# Altium schematic sheet DAC.SchDoc
size Letter
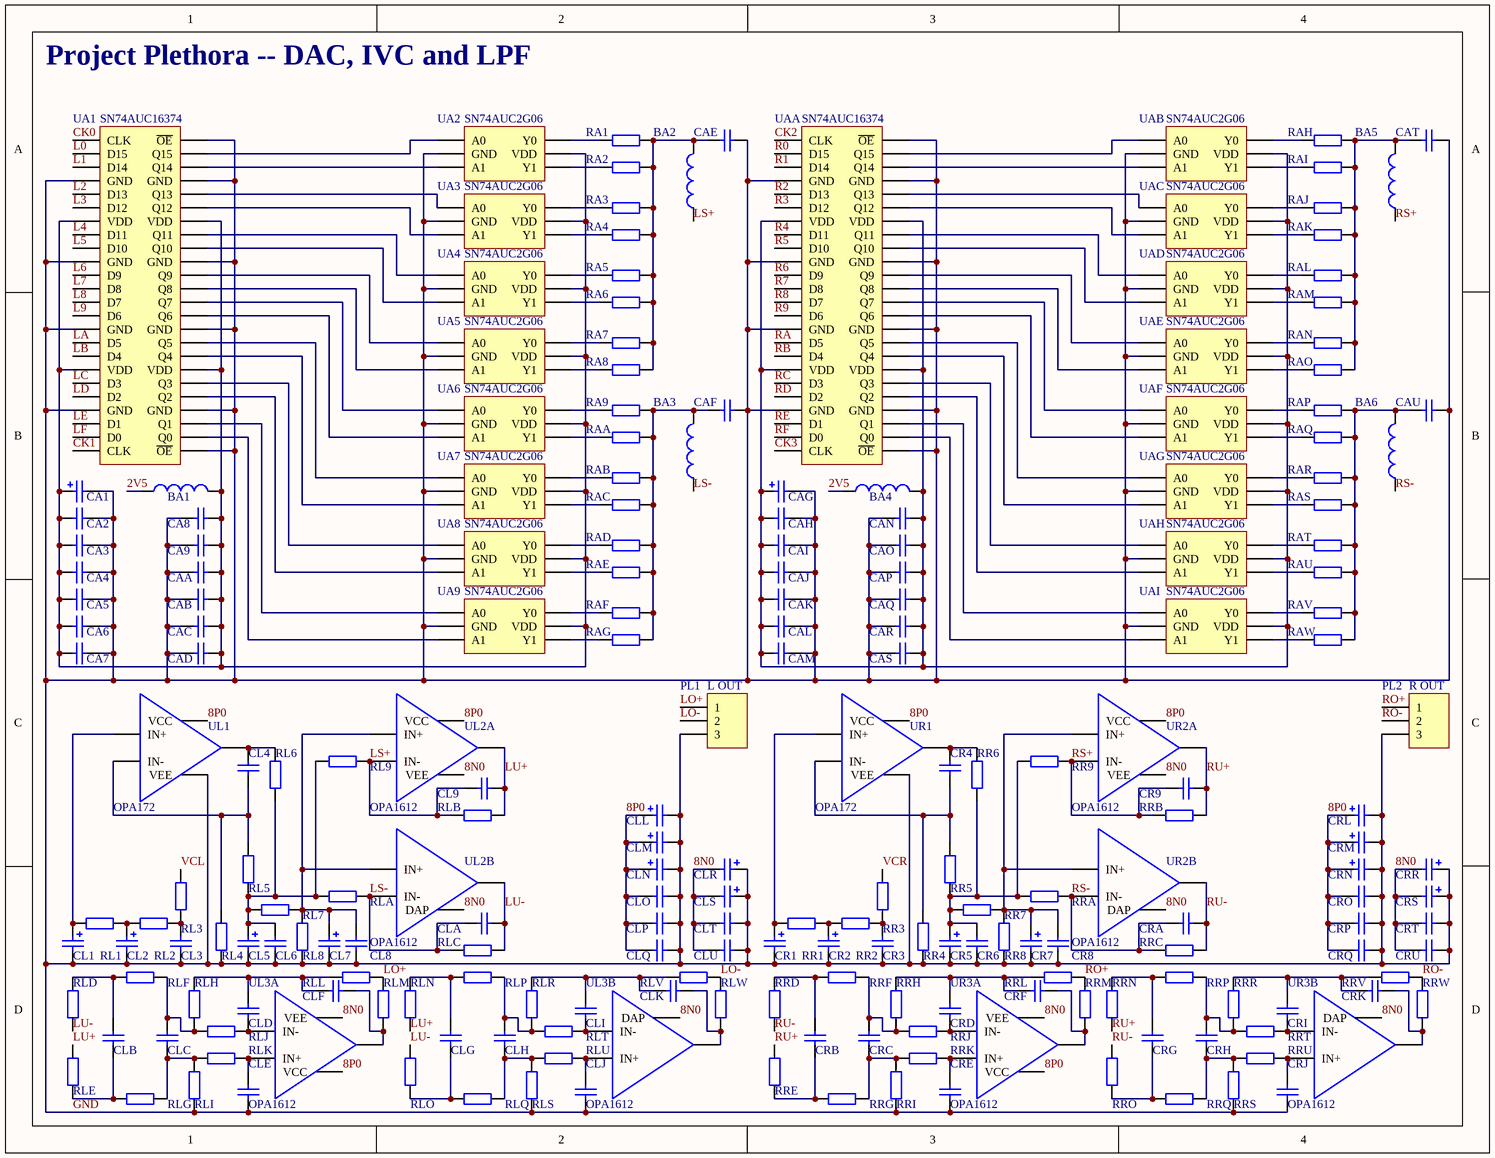
[diagram p0: DAC.SchDoc]

## Parts
BA1  Inductor  [0402]  (value not drawn)
BA2  Inductor  [0402]  (value not drawn)
BA3  Inductor  [0402]  (value not drawn)
BA4  Inductor  [0402]  (value not drawn)
BA5  Inductor  [0402]  (value not drawn)
BA6  Inductor  [0402]  (value not drawn)
CA1  Cap Pol2  [0603]  (value not drawn)
CA2  Cap  [0402]  (value not drawn)
CA3  Cap  [0402]  (value not drawn)
CA4  Cap  [0402]  (value not drawn)
CA5  Cap  [0402]  (value not drawn)
CA6  Cap  [0402]  (value not drawn)
CA7  Cap  [0402]  (value not drawn)
CA8  Cap  [0402]  (value not drawn)
CA9  Cap  [0402]  (value not drawn)
CAA  Cap  [0402]  (value not drawn)
CAB  Cap  [0402]  (value not drawn)
CAC  Cap  [0402]  (value not drawn)
CAD  Cap  [0402]  (value not drawn)
CAE  Cap  [0402]  (value not drawn)
CAF  Cap  [0402]  (value not drawn)
CAG  Cap Pol2  [0603]  (value not drawn)
CAH  Cap  [0402]  (value not drawn)
CAI  Cap  [0402]  (value not drawn)
CAJ  Cap  [0402]  (value not drawn)
CAK  Cap  [0402]  (value not drawn)
CAL  Cap  [0402]  (value not drawn)
CAM  Cap  [0402]  (value not drawn)
CAN  Cap  [0402]  (value not drawn)
CAO  Cap  [0402]  (value not drawn)
CAP  Cap  [0402]  (value not drawn)
CAQ  Cap  [0402]  (value not drawn)
CAR  Cap  [0402]  (value not drawn)
CAS  Cap  [0402]  (value not drawn)
CAT  Cap  [0402]  (value not drawn)
CAU  Cap  [0402]  (value not drawn)
CL1  Cap Pol2  [0603]  (value not drawn)
CL2  Cap Pol2  [0603]  (value not drawn)
CL3  Cap  [0603]  (value not drawn)
CL4  Cap  [0603]  (value not drawn)
CL5  Cap Pol2  [0603]  (value not drawn)
CL6  Cap  [0603]  (value not drawn)
CL7  Cap Pol2  [0603]  (value not drawn)
CL8  Cap  [0603]  (value not drawn)
CL9  Cap  [0603]  (value not drawn)
CLA  Cap  [0603]  (value not drawn)
CLB  Cap  [0603]  (value not drawn)
CLC  Cap  [0603]  (value not drawn)
CLD  Cap  [0603]  (value not drawn)
CLE  Cap  [0603]  (value not drawn)
CLF  Cap  [0603]  (value not drawn)
CLG  Cap  [0603]  (value not drawn)
CLH  Cap  [0603]  (value not drawn)
CLI  Cap  [0603]  (value not drawn)
CLJ  Cap  [0603]  (value not drawn)
CLK  Cap  [0603]  (value not drawn)
CLL  Cap Pol2  [0603]  (value not drawn)
CLM  Cap Pol2  [0603]  (value not drawn)
CLN  Cap Pol2  [0603]  (value not drawn)
CLO  Cap  [0603]  (value not drawn)
CLP  Cap  [0603]  (value not drawn)
CLQ  Cap  [0603]  (value not drawn)
CLR  Cap Pol2  [0603]  (value not drawn)
CLS  Cap Pol2  [0603]  (value not drawn)
CLT  Cap  [0603]  (value not drawn)
CLU  Cap  [0603]  (value not drawn)
CR1  Cap Pol2  [0603]  (value not drawn)
CR2  Cap Pol2  [0603]  (value not drawn)
CR3  Cap  [0603]  (value not drawn)
CR4  Cap  [0603]  (value not drawn)
CR5  Cap Pol2  [0603]  (value not drawn)
CR6  Cap  [0603]  (value not drawn)
CR7  Cap Pol2  [0603]  (value not drawn)
CR8  Cap  [0603]  (value not drawn)
CR9  Cap  [0603]  (value not drawn)
CRA  Cap  [0603]  (value not drawn)
CRB  Cap  [0603]  (value not drawn)
CRC  Cap  [0603]  (value not drawn)
CRD  Cap  [0603]  (value not drawn)
CRE  Cap  [0603]  (value not drawn)
CRF  Cap  [0603]  (value not drawn)
CRG  Cap  [0603]  (value not drawn)
CRH  Cap  [0603]  (value not drawn)
CRI  Cap  [0603]  (value not drawn)
CRJ  Cap  [0603]  (value not drawn)
CRK  Cap  [0603]  (value not drawn)
CRL  Cap Pol2  [0603]  (value not drawn)
CRM  Cap Pol2  [0603]  (value not drawn)
CRN  Cap Pol2  [0603]  (value not drawn)
CRO  Cap  [0603]  (value not drawn)
CRP  Cap  [0603]  (value not drawn)
CRQ  Cap  [0603]  (value not drawn)
CRR  Cap Pol2  [0603]  (value not drawn)
CRS  Cap Pol2  [0603]  (value not drawn)
CRT  Cap  [0603]  (value not drawn)
CRU  Cap  [0603]  (value not drawn)
PL1  L OUT  [HDR1X3]
PL2  R OUT  [HDR1X3]
RA1  Res2  [0402]  (value not drawn)
RA2  Res2  [0402]  (value not drawn)
RA3  Res2  [0402]  (value not drawn)
RA4  Res2  [0402]  (value not drawn)
RA5  Res2  [0402]  (value not drawn)
RA6  Res2  [0402]  (value not drawn)
RA7  Res2  [0402]  (value not drawn)
RA8  Res2  [0402]  (value not drawn)
RA9  Res2  [0402]  (value not drawn)
RAA  Res2  [0402]  (value not drawn)
RAB  Res2  [0402]  (value not drawn)
RAC  Res2  [0402]  (value not drawn)
RAD  Res2  [0402]  (value not drawn)
RAE  Res2  [0402]  (value not drawn)
RAF  Res2  [0402]  (value not drawn)
RAG  Res2  [0402]  (value not drawn)
RAH  Res2  [0402]  (value not drawn)
RAI  Res2  [0402]  (value not drawn)
RAJ  Res2  [0402]  (value not drawn)
RAK  Res2  [0402]  (value not drawn)
RAL  Res2  [0402]  (value not drawn)
RAM  Res2  [0402]  (value not drawn)
RAN  Res2  [0402]  (value not drawn)
RAO  Res2  [0402]  (value not drawn)
RAP  Res2  [0402]  (value not drawn)
RAQ  Res2  [0402]  (value not drawn)
RAR  Res2  [0402]  (value not drawn)
RAS  Res2  [0402]  (value not drawn)
RAT  Res2  [0402]  (value not drawn)
RAU  Res2  [0402]  (value not drawn)
RAV  Res2  [0402]  (value not drawn)
RAW  Res2  [0402]  (value not drawn)
RL1  Res2  [0402]  (value not drawn)
RL2  Res2  [0402]  (value not drawn)
RL3  Res2  [0402]  (value not drawn)
RL4  Res2  [0402]  (value not drawn)
RL5  Res2  [0402]  (value not drawn)
RL6  Res2  [0402]  (value not drawn)
RL7  Res2  [0402]  (value not drawn)
RL8  Res2  [0402]  (value not drawn)
RL9  Res2  [0402]  (value not drawn)
RLA  Res2  [0402]  (value not drawn)
RLB  Res2  [0402]  (value not drawn)
RLC  Res2  [0402]  (value not drawn)
RLD  Res2  [0402]  (value not drawn)
RLE  Res2  [0402]  (value not drawn)
RLF  Res2  [0402]  (value not drawn)
RLG  Res2  [0402]  (value not drawn)
RLH  Res2  [0402]  (value not drawn)
RLI  Res2  [0402]  (value not drawn)
RLJ  Res2  [0402]  (value not drawn)
RLK  Res2  [0402]  (value not drawn)
RLL  Res2  [0402]  (value not drawn)
RLM  Res2  [0402]  (value not drawn)
RLN  Res2  [0402]  (value not drawn)
RLO  Res2  [0402]  (value not drawn)
RLP  Res2  [0402]  (value not drawn)
RLQ  Res2  [0402]  (value not drawn)
RLR  Res2  [0402]  (value not drawn)
RLS  Res2  [0402]  (value not drawn)
RLT  Res2  [0402]  (value not drawn)
RLU  Res2  [0402]  (value not drawn)
RLV  Res2  [0402]  (value not drawn)
RLW  Res2  [0402]  (value not drawn)
RR1  Res2  [0402]  (value not drawn)
RR2  Res2  [0402]  (value not drawn)
RR3  Res2  [0402]  (value not drawn)
RR4  Res2  [0402]  (value not drawn)
RR5  Res2  [0402]  (value not drawn)
RR6  Res2  [0402]  (value not drawn)
RR7  Res2  [0402]  (value not drawn)
RR8  Res2  [0402]  (value not drawn)
RR9  Res2  [0402]  (value not drawn)
RRA  Res2  [0402]  (value not drawn)
RRB  Res2  [0402]  (value not drawn)
RRC  Res2  [0402]  (value not drawn)
RRD  Res2  [0402]  (value not drawn)
RRE  Res2  [0402]  (value not drawn)
RRF  Res2  [0402]  (value not drawn)
RRG  Res2  [0402]  (value not drawn)
RRH  Res2  [0402]  (value not drawn)
RRI  Res2  [0402]  (value not drawn)
RRJ  Res2  [0402]  (value not drawn)
RRK  Res2  [0402]  (value not drawn)
RRL  Res2  [0402]  (value not drawn)
RRM  Res2  [0402]  (value not drawn)
RRN  Res2  [0402]  (value not drawn)
RRO  Res2  [0402]  (value not drawn)
RRP  Res2  [0402]  (value not drawn)
RRQ  Res2  [0402]  (value not drawn)
RRR  Res2  [0402]  (value not drawn)
RRS  Res2  [0402]  (value not drawn)
RRT  Res2  [0402]  (value not drawn)
RRU  Res2  [0402]  (value not drawn)
RRV  Res2  [0402]  (value not drawn)
RRW  Res2  [0402]  (value not drawn)
UA1  SN74AUC16374  [TSSOP48]
UA2  SN74AUC2G06  [SC706]
UA3  SN74AUC2G06  [SC706]
UA4  SN74AUC2G06  [SC706]
UA5  SN74AUC2G06  [SC706]
UA6  SN74AUC2G06  [SC706]
UA7  SN74AUC2G06  [SC706]
UA8  SN74AUC2G06  [SC706]
UA9  SN74AUC2G06  [SC706]
UAA  SN74AUC16374  [TSSOP48]
UAB  SN74AUC2G06  [SC706]
UAC  SN74AUC2G06  [SC706]
UAD  SN74AUC2G06  [SC706]
UAE  SN74AUC2G06  [SC706]
UAF  SN74AUC2G06  [SC706]
UAG  SN74AUC2G06  [SC706]
UAH  SN74AUC2G06  [SC706]
UAI  SN74AUC2G06  [SC706]
UL1  OPA172  [SC705]
UL2  OPA1612  [DFN8]  (parts A,B of 2)
UL3  OPA1612  [DFN8]  (parts A,B of 2)
UR1  OPA172  [SC705]
UR2  OPA1612  [DFN8]  (parts A,B of 2)
UR3  OPA1612  [DFN8]  (parts A,B of 2)

## Nets
2V5: BA1.1 BA4.1
8N0: CLR.2 CLS.2 CLT.1 CLU.1 CRR.2 CRS.2 CRT.1 CRU.1 UL2.4(VEE) UL2.9(DAP) UL3.4(VEE) UL3.9(DAP) UR2.4(VEE) UR2.9(DAP) UR3.4(VEE) UR3.9(DAP)
8P0: CLL.1 CLM.1 CLN.1 CLO.2 CLP.2 CLQ.2 CRL.1 CRM.1 CRN.1 CRO.2 CRP.2 CRQ.2 UL1.5(VCC) UL2.8(VCC) UL3.8(VCC) UR1.5(VCC) UR2.8(VCC) UR3.8(VCC)
CK0: UA1.25(CLK)
CK1: UA1.48(CLK)
CK2: UAA.25(CLK)
CK3: UAA.48(CLK)
GND: CA1.2 CA2.2 CA3.2 CA4.2 CA5.2 CA6.2 CA7.2 CA8.1 CA9.1 CAA.1 CAB.1 CAC.1 CAD.1 CAE.1 CAF.1 CAG.2 CAH.2 CAI.2 CAJ.2 CAK.2 CAL.2 CAM.2 CAN.1 CAO.1 CAP.1 CAQ.1 CAR.1 CAS.1 CAT.1 CAU.1 CL1.2 CL2.2 CL3.1 CL5.2 CL6.1 CL7.2 CL8.1 CLE.2 CLJ.2 CLL.2 CLM.2 CLN.2 CLO.1 CLP.1 CLQ.1 CLR.1 CLS.1 CLT.2 CLU.2 CR1.2 CR2.2 CR3.1 CR5.2 CR6.1 CR7.2 CR8.1 CRE.2 CRJ.2 CRL.2 CRM.2 CRN.2 CRO.1 CRP.1 CRQ.1 CRR.1 CRS.1 CRT.2 CRU.2 PL1.3 PL2.3 RL4.1 RL8.1 RLI.1 RLS.1 RR4.1 RR8.1 RRI.1 RRS.1 UA1.1(~{OE}) UA1.4(GND) UA1.10(GND) UA1.15(GND) UA1.21(GND) UA1.24(~{OE}) UA1.28(GND) UA1.34(GND) UA1.39(GND) UA1.45(GND) UA2.2(GND) UA3.2(GND) UA4.2(GND) UA5.2(GND) UA6.2(GND) UA7.2(GND) UA8.2(GND) UA9.2(GND) UAA.1(~{OE}) UAA.4(GND) UAA.10(GND) UAA.15(GND) UAA.21(GND) UAA.24(~{OE}) UAA.28(GND) UAA.34(GND) UAA.39(GND) UAA.45(GND) UAB.2(GND) UAC.2(GND) UAD.2(GND) UAE.2(GND) UAF.2(GND) UAG.2(GND) UAH.2(GND) UAI.2(GND) UL1.2(VEE) UR1.2(VEE)
L0: UA1.26(D15)
L1: UA1.27(D14)
L2: UA1.29(D13)
L3: UA1.30(D12)
L4: UA1.32(D11)
L5: UA1.33(D10)
L6: UA1.35(D9)
L7: UA1.36(D8)
L8: UA1.37(D7)
L9: UA1.38(D6)
LA: UA1.40(D5)
LB: UA1.41(D4)
LC: UA1.43(D3)
LD: UA1.44(D2)
LE: UA1.46(D1)
LF: UA1.47(D0)
LO+: PL1.1 RLL.2 RLM.1
LO-: PL1.2 RLV.2 RLW.1
LS+: BA2.1 CL9.2 RL9.2 RLB.1 UL2.2(IN-)
LS-: BA3.1 CLA.2 RLA.2 RLC.1 UL2.6(IN-)
LU+: CL9.1 RLB.2 RLE.2 RLN.1 UL2.1
LU-: CLA.1 RLC.2 RLD.1 RLO.2 UL2.7
R0: UAA.26(D15)
R1: UAA.27(D14)
R2: UAA.29(D13)
R3: UAA.30(D12)
R4: UAA.32(D11)
R5: UAA.33(D10)
R6: UAA.35(D9)
R7: UAA.36(D8)
R8: UAA.37(D7)
R9: UAA.38(D6)
RA: UAA.40(D5)
RB: UAA.41(D4)
RC: UAA.43(D3)
RD: UAA.44(D2)
RE: UAA.46(D1)
RF: UAA.47(D0)
RO+: PL2.1 RRL.2 RRM.1
RO-: PL2.2 RRV.2 RRW.1
RS+: BA5.1 CR9.2 RR9.2 RRB.1 UR2.2(IN-)
RS-: BA6.1 CRA.2 RRA.2 RRC.1 UR2.6(IN-)
RU+: CR9.1 RRB.2 RRE.2 RRN.1 UR2.1
RU-: CRA.1 RRC.2 RRD.1 RRO.2 UR2.7
VCL: RL3.2
VCR: RR3.2
NetBA1_2: BA1.2 CA1.1 CA2.1 CA3.1 CA4.1 CA5.1 CA6.1 CA7.1 CA8.2 CA9.2 CAA.2 CAB.2 CAC.2 CAD.2 UA1.7(VDD) UA1.18(VDD) UA1.31(VDD) UA1.42(VDD) UA2.5(VDD) UA3.5(VDD) UA4.5(VDD) UA5.5(VDD) UA6.5(VDD) UA7.5(VDD) UA8.5(VDD) UA9.5(VDD)
NetBA2_2: BA2.2 CAE.2 RA1.2 RA2.2 RA3.2 RA4.2 RA5.2 RA6.2 RA7.2 RA8.2
NetBA3_2: BA3.2 CAF.2 RA9.2 RAA.2 RAB.2 RAC.2 RAD.2 RAE.2 RAF.2 RAG.2
NetBA4_2: BA4.2 CAG.1 CAH.1 CAI.1 CAJ.1 CAK.1 CAL.1 CAM.1 CAN.2 CAO.2 CAP.2 CAQ.2 CAR.2 CAS.2 UAA.7(VDD) UAA.18(VDD) UAA.31(VDD) UAA.42(VDD) UAB.5(VDD) UAC.5(VDD) UAD.5(VDD) UAE.5(VDD) UAF.5(VDD) UAG.5(VDD) UAH.5(VDD) UAI.5(VDD)
NetBA5_2: BA5.2 CAT.2 RAH.2 RAI.2 RAJ.2 RAK.2 RAL.2 RAM.2 RAN.2 RAO.2
NetBA6_2: BA6.2 CAU.2 RAP.2 RAQ.2 RAR.2 RAS.2 RAT.2 RAU.2 RAV.2 RAW.2
NetCL1_1: CL1.1 RL1.1 UL1.3(IN+)
NetCL2_1: CL2.1 RL1.2 RL2.2
NetCL3_2: CL3.2 RL2.1 RL3.1
NetCL4_1: CL4.1 RL4.2 RL5.2 UL1.4(IN-)
NetCL4_2: CL4.2 RL6.2 UL1.1
NetCL5_1: CL5.1 CL6.2 RL5.1 RL6.1 RL7.2 RL9.1 RLA.1
NetCL7_1: CL7.1 CL8.2 RL7.1 RL8.2 UL2.3(IN+) UL2.5(IN+)
NetCLB_1: CLB.1 RLE.1 RLG.2
NetCLB_2: CLB.2 RLD.2 RLF.2
NetCLC_1: CLC.1 RLG.1 RLI.2 RLK.2
NetCLC_2: CLC.2 RLF.1 RLH.1 RLJ.2
NetCLD_1: CLD.1 RLJ.1 UL3.2(IN-)
NetCLD_2: CLD.2 CLF.2 RLH.2 RLL.1
NetCLE_1: CLE.1 RLK.1 UL3.3(IN+)
NetCLF_1: CLF.1 RLM.2 UL3.1
NetCLG_1: CLG.1 RLO.1 RLQ.2
NetCLG_2: CLG.2 RLN.2 RLP.2
NetCLH_1: CLH.1 RLQ.1 RLS.2 RLU.2
NetCLH_2: CLH.2 RLP.1 RLR.1 RLT.2
NetCLI_1: CLI.1 RLT.1 UL3.6(IN-)
NetCLI_2: CLI.2 CLK.1 RLR.2 RLV.1
NetCLJ_1: CLJ.1 RLU.1 UL3.5(IN+)
NetCLK_2: CLK.2 RLW.2 UL3.7
NetCR1_1: CR1.1 RR1.1 UR1.3(IN+)
NetCR2_1: CR2.1 RR1.2 RR2.2
NetCR3_2: CR3.2 RR2.1 RR3.1
NetCR4_1: CR4.1 RR4.2 RR5.2 UR1.4(IN-)
NetCR4_2: CR4.2 RR6.2 UR1.1
NetCR5_1: CR5.1 CR6.2 RR5.1 RR6.1 RR7.2 RR9.1 RRA.1
NetCR7_1: CR7.1 CR8.2 RR7.1 RR8.2 UR2.3(IN+) UR2.5(IN+)
NetCRB_1: CRB.1 RRE.1 RRG.2
NetCRB_2: CRB.2 RRD.2 RRF.2
NetCRC_1: CRC.1 RRG.1 RRI.2 RRK.2
NetCRC_2: CRC.2 RRF.1 RRH.1 RRJ.2
NetCRD_1: CRD.1 RRJ.1 UR3.2(IN-)
NetCRD_2: CRD.2 CRF.1 RRH.2 RRL.1
NetCRE_1: CRE.1 RRK.1 UR3.3(IN+)
NetCRF_2: CRF.2 RRM.2 UR3.1
NetCRG_1: CRG.1 RRO.1 RRQ.2
NetCRG_2: CRG.2 RRN.2 RRP.2
NetCRH_1: CRH.1 RRQ.1 RRS.2 RRU.2
NetCRH_2: CRH.2 RRP.1 RRR.1 RRT.2
NetCRI_1: CRI.1 RRT.1 UR3.6(IN-)
NetCRI_2: CRI.2 CRK.1 RRR.2 RRV.1
NetCRJ_1: CRJ.1 RRU.1 UR3.5(IN+)
NetCRK_2: CRK.2 RRW.2 UR3.7
NetRA1_1: RA1.1 UA2.6(Y0)
NetRA2_1: RA2.1 UA2.4(Y1)
NetRA3_1: RA3.1 UA3.6(Y0)
NetRA4_1: RA4.1 UA3.4(Y1)
NetRA5_1: RA5.1 UA4.6(Y0)
NetRA6_1: RA6.1 UA4.4(Y1)
NetRA7_1: RA7.1 UA5.6(Y0)
NetRA8_1: RA8.1 UA5.4(Y1)
NetRA9_1: RA9.1 UA6.6(Y0)
NetRAA_1: RAA.1 UA6.4(Y1)
NetRAB_1: RAB.1 UA7.6(Y0)
NetRAC_1: RAC.1 UA7.4(Y1)
NetRAD_1: RAD.1 UA8.6(Y0)
NetRAE_1: RAE.1 UA8.4(Y1)
NetRAF_1: RAF.1 UA9.6(Y0)
NetRAG_1: RAG.1 UA9.4(Y1)
NetRAH_1: RAH.1 UAB.6(Y0)
NetRAI_1: RAI.1 UAB.4(Y1)
NetRAJ_1: RAJ.1 UAC.6(Y0)
NetRAK_1: RAK.1 UAC.4(Y1)
NetRAL_1: RAL.1 UAD.6(Y0)
NetRAM_1: RAM.1 UAD.4(Y1)
NetRAN_1: RAN.1 UAE.6(Y0)
NetRAO_1: RAO.1 UAE.4(Y1)
NetRAP_1: RAP.1 UAF.6(Y0)
NetRAQ_1: RAQ.1 UAF.4(Y1)
NetRAR_1: RAR.1 UAG.6(Y0)
NetRAS_1: RAS.1 UAG.4(Y1)
NetRAT_1: RAT.1 UAH.6(Y0)
NetRAU_1: RAU.1 UAH.4(Y1)
NetRAV_1: RAV.1 UAI.6(Y0)
NetRAW_1: RAW.1 UAI.4(Y1)
NetUA1_2: UA1.2(Q0) UA9.3(A1)
NetUA1_3: UA1.3(Q1) UA9.1(A0)
NetUA1_5: UA1.5(Q2) UA8.3(A1)
NetUA1_6: UA1.6(Q3) UA8.1(A0)
NetUA1_8: UA1.8(Q4) UA7.3(A1)
NetUA1_9: UA1.9(Q5) UA7.1(A0)
NetUA1_11: UA1.11(Q6) UA6.3(A1)
NetUA1_12: UA1.12(Q7) UA6.1(A0)
NetUA1_13: UA1.13(Q8) UA5.3(A1)
NetUA1_14: UA1.14(Q9) UA5.1(A0)
NetUA1_16: UA1.16(Q10) UA4.3(A1)
NetUA1_17: UA1.17(Q11) UA4.1(A0)
NetUA1_19: UA1.19(Q12) UA3.3(A1)
NetUA1_20: UA1.20(Q13) UA3.1(A0)
NetUA1_22: UA1.22(Q14) UA2.3(A1)
NetUA1_23: UA1.23(Q15) UA2.1(A0)
NetUAA_2: UAA.2(Q0) UAI.3(A1)
NetUAA_3: UAA.3(Q1) UAI.1(A0)
NetUAA_5: UAA.5(Q2) UAH.3(A1)
NetUAA_6: UAA.6(Q3) UAH.1(A0)
NetUAA_8: UAA.8(Q4) UAG.3(A1)
NetUAA_9: UAA.9(Q5) UAG.1(A0)
NetUAA_11: UAA.11(Q6) UAF.3(A1)
NetUAA_12: UAA.12(Q7) UAF.1(A0)
NetUAA_13: UAA.13(Q8) UAE.3(A1)
NetUAA_14: UAA.14(Q9) UAE.1(A0)
NetUAA_16: UAA.16(Q10) UAD.3(A1)
NetUAA_17: UAA.17(Q11) UAD.1(A0)
NetUAA_19: UAA.19(Q12) UAC.3(A1)
NetUAA_20: UAA.20(Q13) UAC.1(A0)
NetUAA_22: UAA.22(Q14) UAB.3(A1)
NetUAA_23: UAA.23(Q15) UAB.1(A0)

## Notes on the sheet
- Project Plethora -- DAC, IVC and LPF

## Library data of the parts
BA1-BA6 = Inductor: Code_IEC: 1005; Value: 10mH; Published: 8-Jun-2000; LatestRevisionDate: 29-May-2009; LatestRevisionNote: IPC-7351 Footprint Added.; PackageReference: 0402-A; Publisher: Altium Limited; PackageDescription: Chip Inductor; Code_JEITA: 0402
CA1 CAG CL1 CL2 CL5 CL7 CLL CLM CLN CLR CLS CR1 CR2 CR5 CR7 CRL CRM CRN CRR CRS = Cap Pol2: Polarized Capacitor (Axial); Value: 100pF; Published: 8-Jun-2000; LatestRevisionDate: 17-Jul-2002; LatestRevisionNote: Re-released for DXP Platform.; PackageReference: POLAR0.8; Publisher: Altium Limited; PackageDescription: Polarized Capacitor; 2 Leads
CA2-CA9 CAA CAB CAC CAD CAE CAF CAH CAI CAJ CAK CAL CAM CAN CAO CAP CAQ CAR CAS CAT CAU CL3 CL4 CL6 CL8 CL9 CLA CLB CLC CLD CLE CLF CLG CLH CLI CLJ CLK CLO CLP CLQ CLT CLU CR3 CR4 CR6 CR8 CR9 CRA CRB CRC CRD CRE CRF CRG CRH CRI CRJ CRK CRO CRP CRQ CRT CRU = Cap: Capacitor; Value: 100pF; Published: 8-Jun-2000; LatestRevisionDate: 17-Jul-2002; LatestRevisionNote: Re-released for DXP Platform.; PackageReference: RAD-0.3; Publisher: Altium Limited; PackageDescription: Radial Cap, Thru-Hole; 2 Leads; 0.3 in Pin Spacing
PL1 PL2 = Header 3: Header, 3-Pin; LatestRevisionDate: 17-Jul-2002; LatestRevisionNote: Re-released for DXP Platform.; Publisher: Altium Limited
RA1-RA9 RAA RAB RAC RAD RAE RAF RAG RAH RAI RAJ RAK RAL RAM RAN RAO RAP RAQ RAR RAS RAT RAU RAV RAW RL1-RL9 RLA RLB RLC RLD RLE RLF RLG RLH RLI RLJ RLK RLL RLM RLN RLO RLP RLQ RLR RLS RLT RLU RLV RLW RR1-RR9 RRA RRB RRC RRD RRE RRF RRG RRH RRI RRJ RRK RRL RRM RRN RRO RRP RRQ RRR RRS RRT RRU RRV RRW = Res2: Resistor; Value: 1K; Published: 8-Jun-2000; LatestRevisionDate: 17-Jul-2002; LatestRevisionNote: Re-released for DXP Platform.; PackageReference: AXIAL-0.4; Publisher: Altium Limited; PackageDescription: Axial Device, Thru-Hole; 2 Leads; 0.4 in Pin Spacing